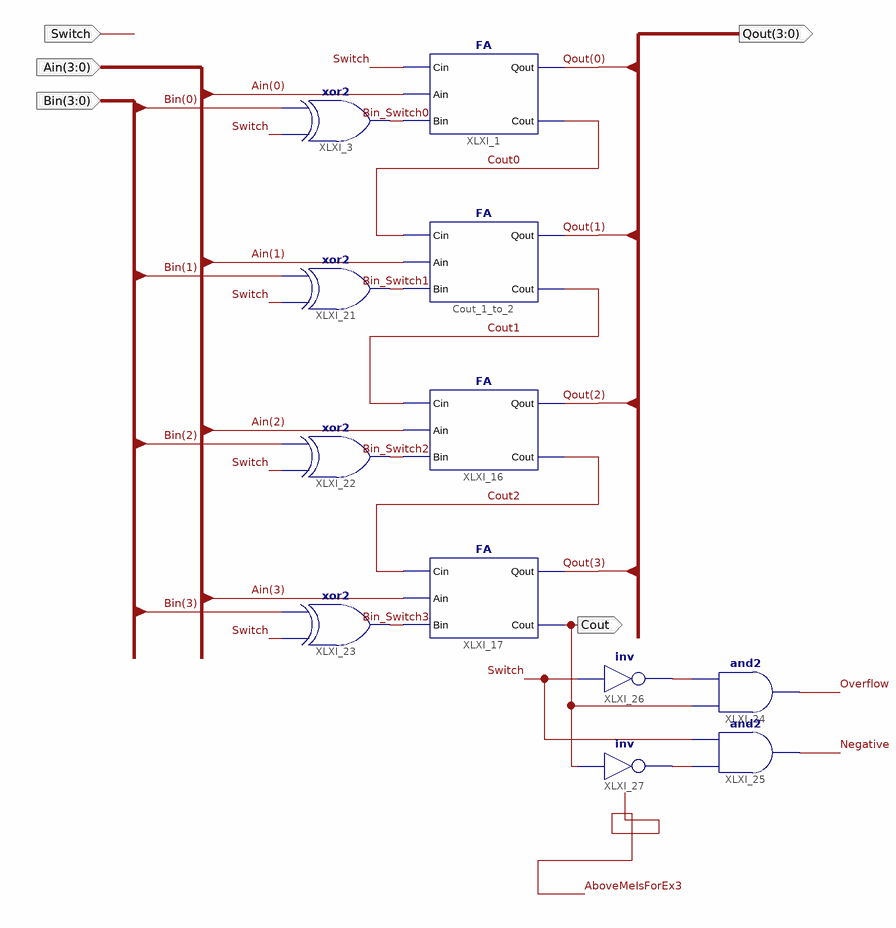
[diagram p0: schematic sheet 1]
// Xilinx ISE schematic Lab5_Ex2.sch (spartan3e) as structural Verilog: 12 symbols, 5 ports
module Lab5_Ex2 (
  input  [3:0] Bin,
  input  [3:0] Ain,
  input  Switch,
  output [3:0] Qout,
  output Cout
);

  wire Bin_Switch0, Bin_Switch1, Bin_Switch2, Bin_Switch3, Cout0, Cout1, Cout2, Negative, Overflow, XLXN_46,
       XLXN_49;

  FA Cout_1_to_2 (.Cin(Cout0), .Ain(Ain[1]), .Bin(Bin_Switch1), .Qout(Qout[1]), .Cout(Cout1));
  FA XLXI_1 (.Cin(Switch), .Ain(Ain[0]), .Bin(Bin_Switch0), .Qout(Qout[0]), .Cout(Cout0));
  xor XLXI_3 (Bin_Switch0, Switch, Bin[0]);
  FA XLXI_16 (.Cin(Cout1), .Ain(Ain[2]), .Bin(Bin_Switch2), .Qout(Qout[2]), .Cout(Cout2));
  FA XLXI_17 (.Cin(Cout2), .Ain(Ain[3]), .Bin(Bin_Switch3), .Qout(Qout[3]), .Cout(Cout));
  xor XLXI_21 (Bin_Switch1, Switch, Bin[1]);
  xor XLXI_22 (Bin_Switch2, Switch, Bin[2]);
  xor XLXI_23 (Bin_Switch3, Switch, Bin[3]);
  and XLXI_24 (Overflow, Cout, XLXN_46);
  and XLXI_25 (Negative, XLXN_49, Switch);
  not XLXI_26 (XLXN_46, Switch);
  not XLXI_27 (XLXN_49, Cout);
endmodule
